# Altium schematic sheet 升降组23V2.1.0.SchDoc
size A3; SheetNumber: 1; SheetTotal: 1
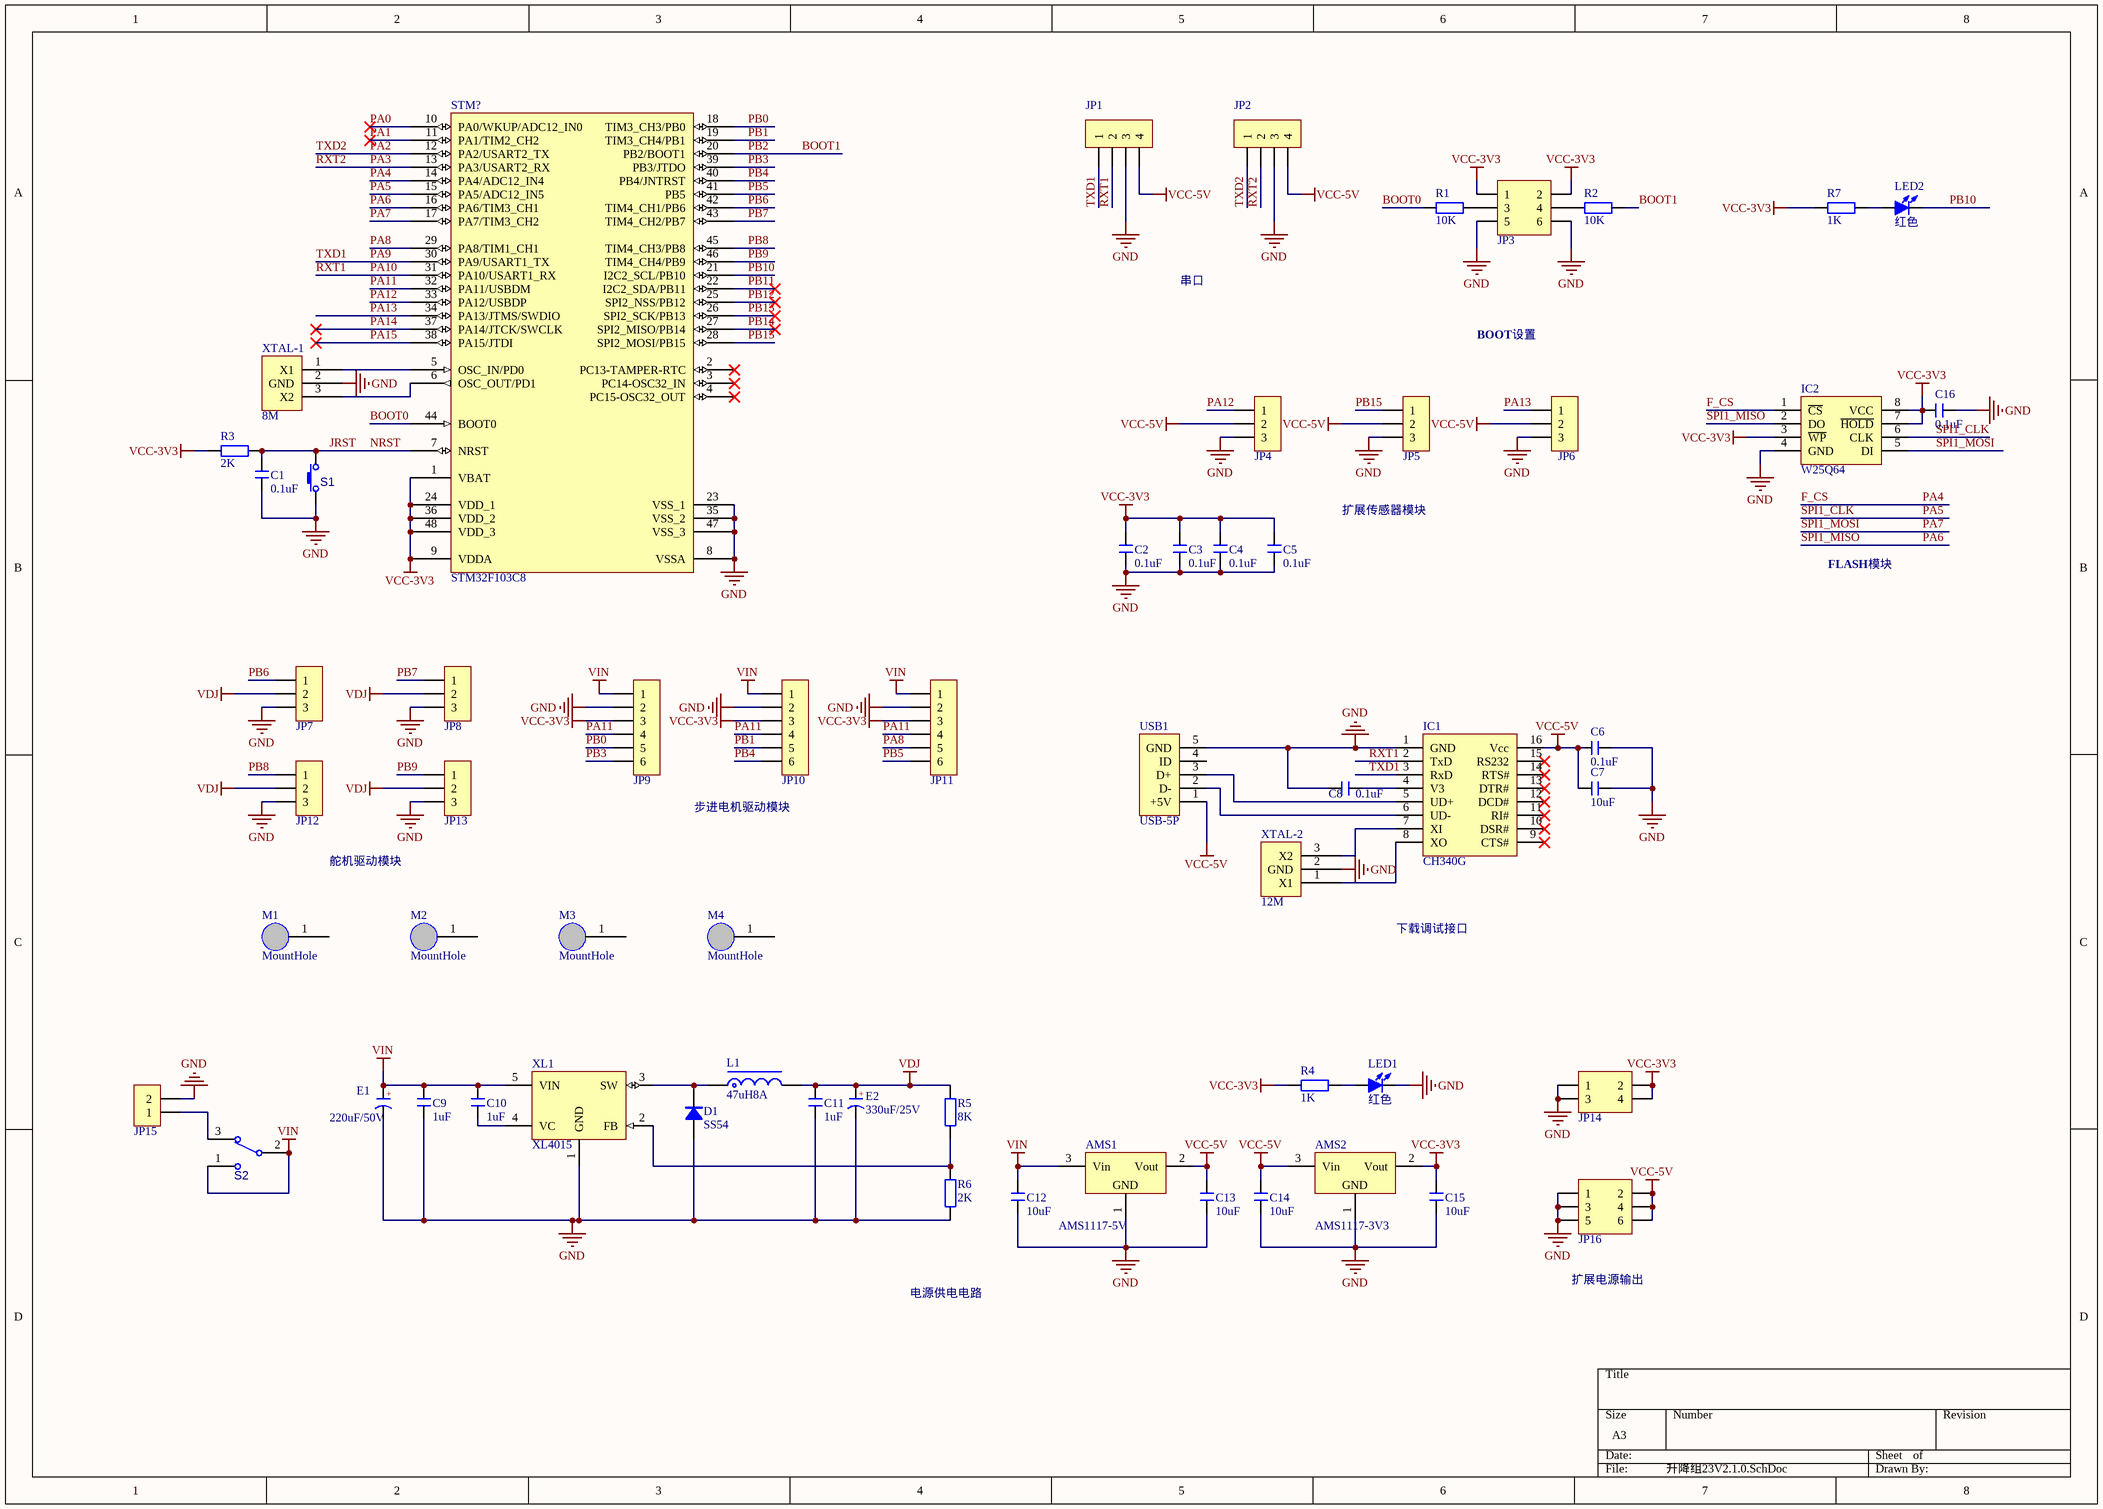
[diagram p0: 升降组23V2.1.0.SchDoc]

## Parts
AMS1  AMS1117-5V  [SOT223_N]
AMS2  AMS1117-3V3  [SOT223_N]
C1  0.1uF  [C 0603_M]
C2  0.1uF  [C 0603_M]
C3  0.1uF  [C 0603_M]
C4  0.1uF  [C 0603_M]
C5  0.1uF  [C 0603_M]
C6  0.1uF  [C 0603_M]
C7  10uF  [C 0603_M]
C8  0.1uF  [C 0603_M]
C9  1uF  [C 0603_M]
C10  1uF  [C 0603_M]
C11  1uF  [C 0603_M]
C12  10uF  [C 0603_M]
C13  10uF  [C 0603_M]
C14  10uF  [C 0603_M]
C15  10uF  [C 0603_M]
C16  0.1uF  [C 0603_M]
D1  SS54  [SMB]
E1  220uF/50V  [CM F(10*10.2)]
E2  330uF/25V  [CM E(8*10.2)]
IC1  CH340G  [SOP16_M]
IC2  W25Q64  [SOP8W_L]
JP1  HDR-1X4  [XH2.54-LI-4P]  (value not drawn)
JP2  HDR-1X4  [XH2.54-LI-4P]  (value not drawn)
JP3  Header3X2  [HDR2.54-LI-2x3P]  (value not drawn)
JP4  HDR-1X3  [HDR2.54-LI-3P]  (value not drawn)
JP5  HDR-1X3  [HDR2.54-LI-3P]  (value not drawn)
JP6  HDR-1X3  [HDR2.54-LI-3P]  (value not drawn)
JP7  HDR-1X3  [HDR2.54-LI-3P]  (value not drawn)
JP8  HDR-1X3  [HDR2.54-LI-3P]  (value not drawn)
JP9  HDR-1X6  [XH2.54-LI-6P]  (value not drawn)
JP10  HDR-1X6  [XH2.54-LI-6P]  (value not drawn)
JP11  HDR-1X6  [XH2.54-LI-6P]  (value not drawn)
JP12  HDR-1X3  [HDR2.54-LI-3P]  (value not drawn)
JP13  HDR-1X3  [HDR2.54-LI-3P]  (value not drawn)
JP14  Header2X2  [HDR2.54-LI-2x2P]  (value not drawn)
JP15  HDR-1X2  [CONN-TH_XT30U-M]  (value not drawn)
JP16  Header3X2  [HDR2.54-LI-2x3P]  (value not drawn)
L1  47uH8A  [CDRH127]
LED1  红色  [LED 0603G]
LED2  红色  [LED 0603G]
M1  MountHole  [M3-MountSlot]  (no BOM)
M2  MountHole  [M3-MountSlot]  (no BOM)
M3  MountHole  [M3-MountSlot]  (no BOM)
M4  MountHole  [M3-MountSlot]  (no BOM)
R1  10K  [R 0603_M]
R2  10K  [R 0603_M]
R3  2K  [R 0603_M]
R4  1K  [R 0603_M]
R5  8K  [R 0603_M]
R6  2K  [R 0603_M]
R7  1K  [R 0603_M]
S1  Button  [PTS810-3*4-CurvePin]  (value not drawn)
S2  SW-SPDT  [SS12D10]  (value not drawn)
STM?  STM32F103C8  [LQFP48 7X7_N]
USB1  USB-5P  [USB-MICRO_A]
XL1  XL4015  [TO263-5A]
XTAL-1  8M  [XTAL_3213]
XTAL-2  12M  [XTAL_3213]

## Nets
GND: AMS1.1(GND) AMS2.1(GND) C1.2 C2.1 C3.1 C4.1 C5.1 C6.2 C7.2 C8.2 C9.1 C11.1 C12.1 C13.1 C14.1 C15.1 C16.1 D1.1(A) E1.2(K) E2.2(K) IC1.1(GND) IC2.4(GND) JP1.3 JP2.3 JP3.5 JP3.6 JP4.3 JP5.3 JP6.3 JP7.3 JP8.3 JP9.2 JP10.2 JP11.2 JP12.3 JP13.3 JP14.1 JP14.3 JP15.2 JP16.1 JP16.3 JP16.5 LED1.2(K) R6.1 S1.2 STM?.8(VSSA) STM?.23(VSS_1) STM?.35(VSS_2) STM?.47(VSS_3) USB1.5(GND) XL1.1(GND) XTAL-1.2(GND) XTAL-2.2(GND)
VCC-3V3: AMS2.2(Vout) C2.2 C3.2 C4.2 C5.2 C15.2 C16.2 IC2.3(~{WP}) IC2.7(~{HOLD}) IC2.8(VCC) JP3.1 JP3.2 JP9.3 JP10.3 JP11.3 JP14.2 JP14.4 R3.1 R4.2 R7.2 STM?.1(VBAT) STM?.9(VDDA) STM?.24(VDD_1) STM?.36(VDD_2) STM?.48(VDD_3)
VCC-5V: AMS1.2(Vout) AMS2.3(Vin) C6.1 C7.1 C13.2 C14.2 IC1.16(Vcc) JP1.4 JP2.4 JP4.2 JP5.2 JP6.2 JP16.2 JP16.4 JP16.6 USB1.1(+5V)
VDJ: C11.2 E2.1(A) JP7.2 JP8.2 JP12.2 JP13.2 L1.2 R5.2
VIN: AMS1.3(Vin) C9.2 C10.2 C12.2 E1.1(A) JP9.1 JP10.1 JP11.1 S2.1 S2.2 XL1.5(VIN)
BOOT0: R1.2 STM?.44(BOOT0)
BOOT1: R2.1 STM?.20(PB2/BOOT1)  [also labelled PB2]
F_CS: IC2.1(~{CS}) STM?.14(PA4/ADC12_IN4)  [also labelled PA4]
JRST: C1.1 R3.2 S1.1 STM?.7(NRST)  [also labelled NRST]
PA0: STM?.10(PA0/WKUP/ADC12_IN0)
PA1: STM?.11(PA1/TIM2_CH2)
PA2: JP2.1 STM?.12(PA2/USART2_TX)  [also labelled TXD2]
PA3: JP2.2 STM?.13(PA3/USART2_RX)  [also labelled RXT2]
PA5: IC2.6(CLK) STM?.15(PA5/ADC12_IN5)  [also labelled SPI1_CLK]
PA6: IC2.2(DO) STM?.16(PA6/TIM3_CH1)  [also labelled SPI1_MISO]
PA7: IC2.5(DI) STM?.17(PA7/TIM3_CH2)  [also labelled SPI1_MOSI]
PA8: JP11.5 STM?.29(PA8/TIM1_CH1)
PA9: IC1.3(RxD) JP1.1 STM?.30(PA9/USART1_TX)  [also labelled TXD1]
PA10: IC1.2(TxD) JP1.2 STM?.31(PA10/USART1_RX)  [also labelled RXT1]
PA11: JP9.4 JP10.4 JP11.4 STM?.32(PA11/USBDM)
PA12: JP4.1 STM?.33(PA12/USBDP)
PA13: JP6.1 STM?.34(PA13/JTMS/SWDIO)
PA14: STM?.37(PA14/JTCK/SWCLK)
PA15: STM?.38(PA15/JTDI)
PB0: JP9.5 STM?.18(TIM3_CH3/PB0)
PB1: JP10.5 STM?.19(TIM3_CH4/PB1)
PB3: JP9.6 STM?.39(PB3/JTDO)
PB4: JP10.6 STM?.40(PB4/JNTRST)
PB5: JP11.6 STM?.41(PB5)
PB6: JP7.1 STM?.42(TIM4_CH1/PB6)
PB7: JP8.1 STM?.43(TIM4_CH2/PB7)
PB8: JP12.1 STM?.45(TIM4_CH3/PB8)
PB9: JP13.1 STM?.46(TIM4_CH4/PB9)
PB10: LED2.2(K) STM?.21(I2C2_SCL/PB10)
PB11: STM?.22(I2C2_SDA/PB11)
PB12: STM?.25(SPI2_NSS/PB12)
PB13: STM?.26(SPI2_SCK/PB13)
PB14: STM?.27(SPI2_MISO/PB14)
PB15: JP5.1 STM?.28(SPI2_MOSI/PB15)
NetC8_1: C8.1 IC1.4(V3)
NetC10_1: C10.1 XL1.4(VC)
NetD1_2: D1.2(K) L1.1 XL1.3(SW)
NetIC1_5: IC1.5(UD+) USB1.3(D+)
NetIC1_6: IC1.6(UD-) USB1.2(D-)
NetIC1_7: IC1.7(XI) XTAL-2.3(X2)
NetIC1_8: IC1.8(XO) XTAL-2.1(X1)
NetJP3_3: JP3.3 R1.1
NetJP3_4: JP3.4 R2.2
NetJP15_1: JP15.1 S2.3
NetLED1_1: LED1.1(A) R4.1
NetLED2_1: LED2.1(A) R7.1
NetR5_1: R5.1 R6.2 XL1.2(FB)
NetSTM?_5: STM?.5(OSC_IN/PD0) XTAL-1.1(X1)
NetSTM?_6: STM?.6(OSC_OUT/PD1) XTAL-1.3(X2)

Not connected (* = marked no-connect by the designer): IC1 9(CTS#)* 10(DSR#)* 11(RI#)* 12(DCD#)* 13(DTR#)* 14(RTS#)* 15(RS232)*; M1 1; M2 1; M3 1; M4 1; STM? 2(PC13-TAMPER-RTC)* 3(PC14-OSC32_IN)* 4(PC15-OSC32_OUT)*; USB1 4(ID)

## Notes on the sheet
- 串口
- BOOT设置
- 扩展传感器模块
- FLASH模块
- 步进电机驱动模块
- 舵机驱动模块
- 下载调试接口
- 电源供电电路
- 扩展电源输出
- (in symbol C-CM) +

## Library data of the parts
AMS1 AMS2 = AMS1117: 三端稳压芯片; BOM名称: 稳压芯片
C1-C16 = C: 无极性贴片电容; 材质: X7R; BOM名称: 无极性贴片电容
D1 = SS54: 肖特基二极管; 属性: 40V/3A; BOM名称: 肖特基二极管
E1 E2 = C-CM: 贴片电解电容; BOM名称: 贴片电解电容
IC1 = CH340G: 串口转USB; BOM名称: 串口转USB
IC2 = W25Qxx: 外置Flash; BOM名称: 外置Flash
JP1 JP2 = Header 4: 4P接插件; BOM名称: 4P接插件
JP3 JP16 = Header 3X2: 3*2P接插件; BOM名称: 3*2P接插件
JP4-JP8 JP12 JP13 = Header 3: 3P接插件; BOM名称: 3P接插件
JP9-JP11 = Header 6: 6P接插件; BOM名称: 6P接插件
JP14 = Header 2X2: 2*2P接插件; BOM名称: 2*2P接插件
JP15 = Header 2: 2P接插件; BOM名称: 2P接插件
L1 = L-CDRH: 功率屏蔽电感; BOM名称: 功率屏蔽电感
LED1 LED2 = LED-SMD: 贴片LED; BOM名称: 贴片LED
M1-M4 = MountHole_1: 固定孔
R1-R7 = R: 贴片电阻; BOM名称: 贴片电阻
S1 = KEY: 按键; Published: 24-Mar-1999; Publisher: Altium Limited; Price(RMB): 0.000
S2 = SW-SPDT: 单刀双掷开关 3脚船型、钮子、拨动开关 SPDT Subminiature Toggle Switch; Published: 24-Mar-1999; Publisher: Altium Limited; Price(RMB): 0.000
STM? = STM32F103C8: Flaah:64/RAM:20/IO:36; BOM名称: 32位STM单片机
USB1 = USB-5P: 微型USB母座; BOM名称: 微型USB母座
XL1 = XL4015: DC降压芯片; BOM名称: DC降压芯片
XTAL-1 XTAL-2 = XTAL-3P: 三脚无源晶振